# Altium schematic sheet TopLevelDesign.SchDoc
size A; SheetNumber: 2; SheetTotal: 5
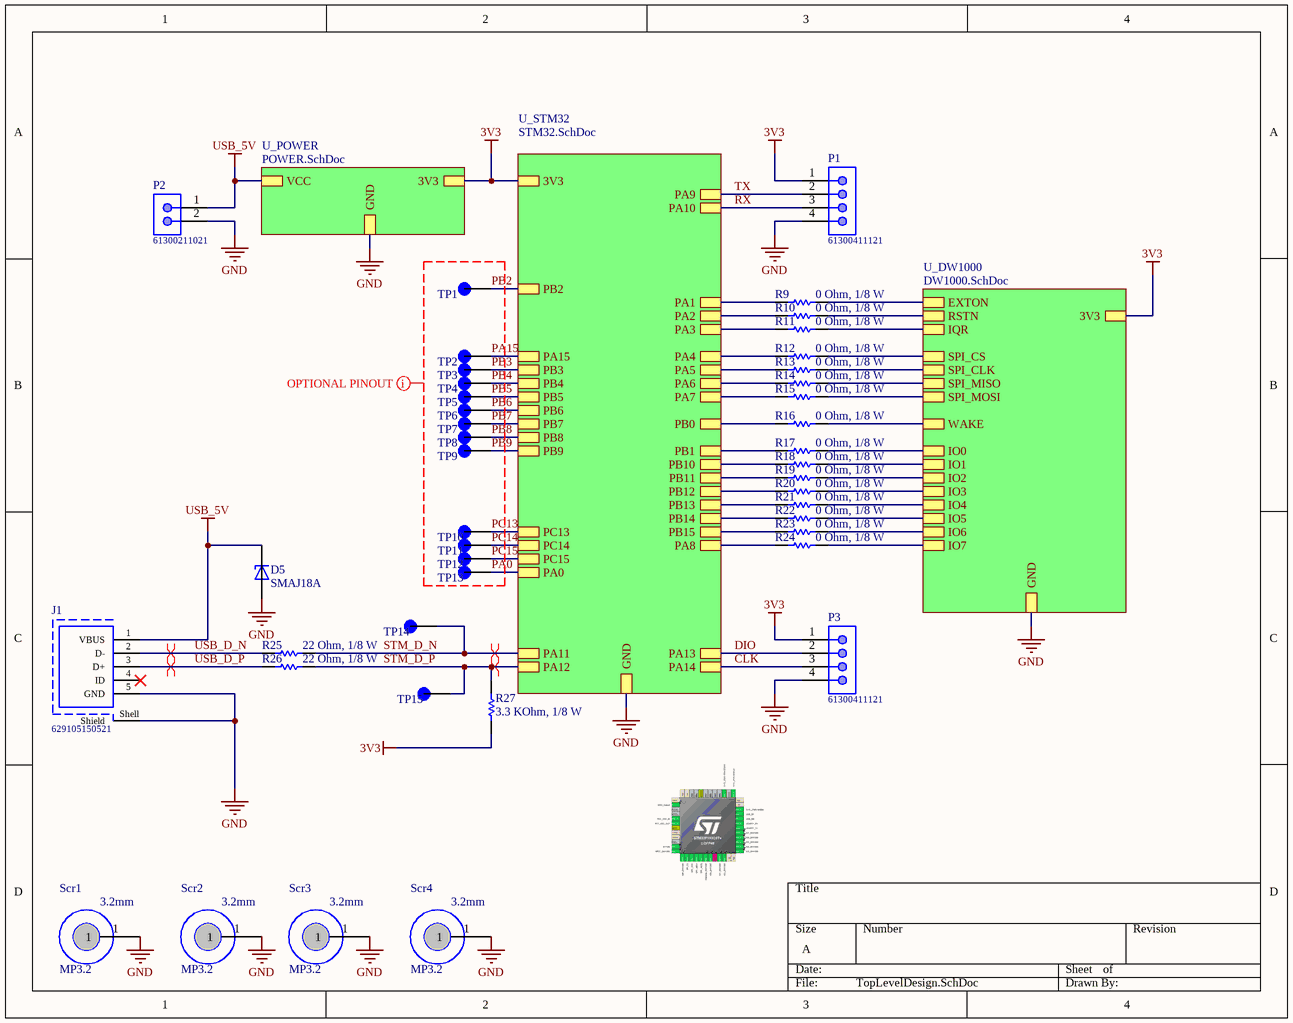
[diagram p0: TopLevelDesign.SchDoc]

## Parts
D5  SMAJ18A  [DIOM4325X250N]
J1  629105150521  [629105150521]
P1  61300411121  [61300411121]
P2  61300211021  [61300211021]
P3  61300411121  [61300411121]
R9  value 0 Ohm, 1/8 W  [RESISTOR_0805]  (hidden comment: 0008050001)
R10  value 0 Ohm, 1/8 W  [RESISTOR_0805]  (hidden comment: 0008050001)
R11  value 0 Ohm, 1/8 W  [RESISTOR_0805]  (hidden comment: 0008050001)
R12  value 0 Ohm, 1/8 W  [RESISTOR_0805]  (hidden comment: 0008050001)
R13  value 0 Ohm, 1/8 W  [RESISTOR_0805]  (hidden comment: 0008050001)
R14  value 0 Ohm, 1/8 W  [RESISTOR_0805]  (hidden comment: 0008050001)
R15  value 0 Ohm, 1/8 W  [RESISTOR_0805]  (hidden comment: 0008050001)
R16  value 0 Ohm, 1/8 W  [RESISTOR_0805]  (hidden comment: 0008050001)
R17  value 0 Ohm, 1/8 W  [RESISTOR_0805]  (hidden comment: 0008050001)
R18  value 0 Ohm, 1/8 W  [RESISTOR_0805]  (hidden comment: 0008050001)
R19  value 0 Ohm, 1/8 W  [RESISTOR_0805]  (hidden comment: 0008050001)
R20  value 0 Ohm, 1/8 W  [RESISTOR_0805]  (hidden comment: 0008050001)
R21  value 0 Ohm, 1/8 W  [RESISTOR_0805]  (hidden comment: 0008050001)
R22  value 0 Ohm, 1/8 W  [RESISTOR_0805]  (hidden comment: 0008050001)
R23  value 0 Ohm, 1/8 W  [RESISTOR_0805]  (hidden comment: 0008050001)
R24  value 0 Ohm, 1/8 W  [RESISTOR_0805]  (hidden comment: 0008050001)
R25  value 22 Ohm, 1/8 W  [RESISTOR_0805]  (hidden comment: 0008052205)
R26  value 22 Ohm, 1/8 W  [RESISTOR_0805]  (hidden comment: 0008052205)
R27  value 3.3 KOhm, 1/8 W  [RESISTOR_0805]  (hidden comment: 0008053325)
Scr1  MP3.2  [MP3.2]
Scr2  MP3.2  [MP3.2]
Scr3  MP3.2  [MP3.2]
Scr4  MP3.2  [MP3.2]
TP1  Keystone_SMD  [KEYSTONE_5019]  (value not drawn)
TP2  Keystone_SMD  [KEYSTONE_5019]  (value not drawn)
TP3  Keystone_SMD  [KEYSTONE_5019]  (value not drawn)
TP4  Keystone_SMD  [KEYSTONE_5019]  (value not drawn)
TP5  Keystone_SMD  [KEYSTONE_5019]  (value not drawn)
TP6  Keystone_SMD  [KEYSTONE_5019]  (value not drawn)
TP7  Keystone_SMD  [KEYSTONE_5019]  (value not drawn)
TP8  Keystone_SMD  [KEYSTONE_5019]  (value not drawn)
TP9  Keystone_SMD  [KEYSTONE_5019]  (value not drawn)
TP10  Keystone_SMD  [KEYSTONE_5019]  (value not drawn)
TP11  Keystone_SMD  [KEYSTONE_5019]  (value not drawn)
TP12  Keystone_SMD  [KEYSTONE_5019]  (value not drawn)
TP13  Keystone_SMD  [KEYSTONE_5019]  (value not drawn)
TP14  Keystone_SMD  [KEYSTONE_5019]  (value not drawn)
TP15  Keystone_SMD  [KEYSTONE_5019]  (value not drawn)

## Sub-sheets
U_DW1000 = DW1000.SchDoc: RSTN, IQR, SPI_CS, SPI_CLK, SPI_MOSI, SPI_MISO, EXTON, IO7, IO6, IO5, IO4, IO3, IO2, IO1, IO0, WAKE, 3V3, GND
U_POWER = POWER.SchDoc: VCC, 3V3, GND
U_STM32 = STM32.SchDoc: PB1, PB10, PB11, PB12, PB13, PB14, PB15, PA8, PA9, PA0, PA13, PA14, PA15, PA1, PA2, PA3, PA4, PA5, PA6, PA7, PB2, PB0, PB3, PB5, PB6, PB4, PB7, PA10, PA11, PB8, PB9, PA12, PC13, PC14, PC15, 3V3, GND

## Nets
3V3: P1.1 P3.1 R27.1 ; sheet U_DW1000/3V3, sheet U_STM32/3V3, sheet U_POWER/3V3
GND: D5.A J1.5(GND) J1.Shell(Shield) P1.4 P2.2 P3.4 Scr1.1 Scr2.1 Scr3.1 Scr4.1 ; sheet U_DW1000/GND, sheet U_STM32/GND, sheet U_POWER/GND
USB_5V: D5.C J1.1(VBUS) P2.1 ; sheet U_POWER/VCC
CLK: P3.3 ; sheet U_STM32/PA14
DIO: P3.2 ; sheet U_STM32/PA13
PA0: TP13.TP ; sheet U_STM32/PA0
PA15: TP2.TP ; sheet U_STM32/PA15
PB2: TP1.TP ; sheet U_STM32/PB2
PB3: TP3.TP ; sheet U_STM32/PB3
PB4: TP4.TP ; sheet U_STM32/PB4
PB5: TP5.TP ; sheet U_STM32/PB5
PB6: TP6.TP ; sheet U_STM32/PB6
PB7: TP7.TP ; sheet U_STM32/PB7
PB8: TP8.TP ; sheet U_STM32/PB8
PB9: TP9.TP ; sheet U_STM32/PB9
PC13: TP10.TP ; sheet U_STM32/PC13
PC14: TP11.TP ; sheet U_STM32/PC14
PC15: TP12.TP ; sheet U_STM32/PC15
RX: P1.3 ; sheet U_STM32/PA10
STM_D_N: R25.2 TP14.TP ; sheet U_STM32/PA11
STM_D_P: R26.2 R27.2 TP15.TP ; sheet U_STM32/PA12
TX: P1.2 ; sheet U_STM32/PA9
USB_D_N: J1.2(D-) R25.1
USB_D_P: J1.3(D+) R26.1
NetR9_1: R9.1 ; sheet U_STM32/PA1
NetR9_2: R9.2 ; sheet U_DW1000/EXTON
NetR10_1: R10.1 ; sheet U_STM32/PA2
NetR10_2: R10.2 ; sheet U_DW1000/RSTN
NetR11_1: R11.1 ; sheet U_STM32/PA3
NetR11_2: R11.2 ; sheet U_DW1000/IQR
NetR12_1: R12.1 ; sheet U_STM32/PA4
NetR12_2: R12.2 ; sheet U_DW1000/SPI_CS
NetR13_1: R13.1 ; sheet U_STM32/PA5
NetR13_2: R13.2 ; sheet U_DW1000/SPI_CLK
NetR14_1: R14.1 ; sheet U_STM32/PA6
NetR14_2: R14.2 ; sheet U_DW1000/SPI_MISO
NetR15_1: R15.1 ; sheet U_STM32/PA7
NetR15_2: R15.2 ; sheet U_DW1000/SPI_MOSI
NetR16_1: R16.1 ; sheet U_STM32/PB0
NetR16_2: R16.2 ; sheet U_DW1000/WAKE
NetR17_1: R17.1 ; sheet U_STM32/PB1
NetR17_2: R17.2 ; sheet U_DW1000/IO0
NetR18_1: R18.1 ; sheet U_STM32/PB10
NetR18_2: R18.2 ; sheet U_DW1000/IO1
NetR19_1: R19.1 ; sheet U_STM32/PB11
NetR19_2: R19.2 ; sheet U_DW1000/IO2
NetR20_1: R20.1 ; sheet U_STM32/PB12
NetR20_2: R20.2 ; sheet U_DW1000/IO3
NetR21_1: R21.1 ; sheet U_STM32/PB13
NetR21_2: R21.2 ; sheet U_DW1000/IO4
NetR22_1: R22.1 ; sheet U_STM32/PB14
NetR22_2: R22.2 ; sheet U_DW1000/IO5
NetR23_1: R23.1 ; sheet U_STM32/PB15
NetR23_2: R23.2 ; sheet U_DW1000/IO6
NetR24_1: R24.1 ; sheet U_STM32/PA8
NetR24_2: R24.2 ; sheet U_DW1000/IO7

Not connected (* = marked no-connect by the designer): J1 4(ID)*

## Layout directives
differential pair: STM_D_N, STM_D_P, USB_D_N, USB_D_P
mark named OPTIONAL PINOUT: PA0, PA15, PB2, PB3, PB4, PB5, PB6, PB7, PB8, PB9, PC13, PC14, PC15

## Notes on the sheet
- (in symbol CMP-143-000000-1) 3.2mm

## Library data of the parts
D5 = CMP-004-00085-1: 400W, 21.1V, 5%, Unidirectional, TVS; MF: Taiwan Semiconductor; SnapEDA_Link: https://www.snapeda.com/parts/SMAJ18A/taiwan/view-part/?ref=snap; Value: *; Component Type: Standard; Case/Package: SMA-2 Taiwan Semiconductor; Check_prices: https://www.snapeda.com/parts/SMAJ18A/taiwan/view-part/?ref=eda; Source: SMAJ18A.SchLib; Design Item ID: SMAJ18A; Pins: 2; MP: SMAJ18A
J1 = CMP-111-000023-1: Micro USB 2.0 Type B Receptacle WR-COM, Horizontal, SMT, with Pegs, High Current at Pin 1 & Pin 5; Contact Resistance: 30 mOhm; Rated Current: 3 A; Working Voltage: 30 VAC; ComponentLink2URL: N/A; Operating Temperature: -40 to 85 degC; Packaging: Tape and Reel; ComponentLink2Description: Supplier 1 URL; Supplier 2 URL: N/A; Source: USB Connectors WR-COM.SchLib; Supplier 1 Name: Mouser; Supplier 1 URL: https://www.mouser.vn/ProductDetail/Wurth-Elektronik/629105150521?qs=a9WhcLg8qCzXiH7kZP8GRQ%3D%3D; Value: Micro USB 2.0 Type B; ComponentLink1Description: Datasheet; ComponentLink1URL: https://katalog.we-online.de/em/datasheet/629105150521.pdf; Published Date: September 2018; Supplier 3 SN: N/A; Pin Count: 6; Connector Type: Micro USB 2.0 Type B; Design Item ID: 629105150521; Component Type: Standard; ComponentLink4URL: N/A; ComponentLink3Description: Supplier 2 URL; Supplier 2 SN: N/A; ComponentLink3URL: N/A; Orientation: Horizontal; Gender: Receptacle; ComponentLink4Description: Supplier 3 URL; Supplier 1 SN: 710-629105150521; Supplier 3 URL: N/A; Supplier 3 Name: thegioiic; Mounting Technology: SMT; Supplier 2 Name: Digi-Key; Part Number: 629105150521; Publisher: Wurth Elektronik
P1 P3 = CMP-002-00474-1: WR-PHD Pin Header, THT, pitch 2.54mm, Single Row, Vertical, 4p; Manufacturer: Wurth Elektronik; Rated Current: 3A; Contact Resistance: 20mOhm; Withstanding Voltage: 500VAC; Supply name 1: Mouser; Pin Number: 4; Working Voltage: 250VAC; Published Date: May 2020; Supplier 3 URL: N/A; Supplier 2 URL: N/A; Source: WR-PHD_Pin Header_2.54mm.SchLib; ComponentLink3Description: Global Supply; Operating Temperature: -40 to +105degC; ComponentLink1Description: Manufacturer; Component Type: Standard; ComponentLink1URL: http://www.we-online.de; ComponentLink2URL: https://www.we-online.com/catalog/datasheet/61300411121.pdf; ComponentLink2Description: Datasheet; ComponentLink4Description: Global Supply; ComponentLink4URL: https://www.mouser.vn/ProductDetail/Wurth-Elektronik/61300411121?qs=PhR8RmCirEYQcLLqXD8rAA%3D%3D; Pitch: 2.54mm; Mounting Technology: THT; Supplier 2 SN: N/A; Row Number: Single; Supplier 3 Name: thegioiic; Supplier 2 Name: Digi-Key; Supplier 1 URL: https://www.mouser.vn/ProductDetail/Wurth-Elektronik/61300311121?qs=PhR8RmCirEYxRWFJzNKsUw%3D%3D; Supplier 1 SN: 710-61300311121; Supplier 3 SN: N/A; Pins: 4; Orientation: Vertical; Gender: Pin Header; Packaging: Bag; ComponentLink3URL: https://www.we-online.com/en/components/products/PHD_2_54_THT_PIN_HEADER_6130XX11121?sq=61300411121#61300411121; Supplier 1 Name: Mouser; Design Item ID: 61300411121; Manufacturer Part Number: 61300411121
P2 = CMP-002-00465-1: WR-PHD Pin Header, THT, pitch 2.54mm, Single Row, Angled, 2p; Manufacturer: Wurth Elektronik; Contact Resistance: 20mOhm; Working Voltage: 250VAC; Supply name 1: Mouser; Pin Number: 2; Rated Current: 3A; Withstanding Voltage: 500VAC; Manufacturer Part Number: 61300211021; Supplier 3 SN: N/A; ComponentLink3Description: Global Supply; Supplier 3 URL: N/A; Supplier 1 URL: https://www.mouser.vn/ProductDetail/Wurth-Elektronik/61300211021?qs=PhR8RmCirEbDcrt4YhPPpA%3D%3D; ComponentLink3URL: https://www.we-online.com/en/components/products/PHD_2_54_THT_ANGLED_PIN_HEADER_6130XX11021?sq=61300211021#61300211021; ComponentLink1Description: Manufacturer; ComponentLink1URL: http://www.we-online.de; Pitch: 2.54mm; Supplier 1 SN: 710-61300211021; Pins: 2; Design Item ID: 61300211021; Supplier 2 SN: N/A; Operating Temperature: -40 to +105degC; Orientation: Angled; ComponentLink2URL: https://www.we-online.com/catalog/datasheet/61300211021.pdf; Component Type: Standard; Source: WR-PHD_Pin Header_2.54mm.SchLib; Supplier 2 URL: N/A; Mounting Technology: THT; Row Number: Single; ComponentLink4Description: Global Supply; ComponentLink4URL: https://www.mouser.vn/ProductDetail/Wurth-Elektronik/61300211021?qs=PhR8RmCirEbDcrt4YhPPpA%3D%3D; ComponentLink2Description: Datasheet; Supplier 3 Name: thegioiic; Supplier 2 Name: Digi-Key; Gender: Pin Header; Supplier 1 Name: Mouser; Packaging: Bag; Published Date: May 2020
R9-R24 = CMP-009-00415-1: RES, size 0805, 0 Ohm, 1/8 W; Manufacture  Name: YAGEO; Manufacture  SN: RC0805FR-070RL; Rated Power: 1/8 W; Resistance Tolerance: +/-1%; ComponentLink1URL: N/A; Component Type: Standard; Mounting Technology: SMT; Source: Resistor_0805.SchLib; ComponentLink3URL: https://www.digikey.com/en/products/detail/yageo/rc0805fr-070rl/2827620; Supplier 3 Name: Thegioiic; Size: 0805; ComponentLink1Description: Datasheet link; Design Item ID: 0008050001; ComponentLink2Description: Supplier 1 URL; Supplier 2 Name: Digi-Key; Supplier 2 SN: 311-0.0CRTR-ND; Supplier 1 URL: https://www.mouser.com/ProductDetail/YAGEO/RC0805FR-070RL?qs=fRxXYNj8ftF6kXqh1XbZJQ%3D%3D; Supplier 2 URL: https://www.digikey.com/en/products/detail/yageo/rc0805fr-070rl/2827620; ComponentLink3Description: Supplier 2 URL; Pins: 2; ComponentLink2URL: https://www.mouser.com/ProductDetail/YAGEO/RC0805FR-070RL?qs=fRxXYNj8ftF6kXqh1XbZJQ%3D%3D; Supplier 1 Name: Mouser; Supplier 3 URL: https://www.thegioiic.com/dien-tro-0-ohm-0805-1-; ComponentLink4URL: https://www.thegioiic.com/dien-tro-0-ohm-0805-1-; Supplier 1 SN: 603-RC0805FR-070RL; ComponentLink4Description: Supplier 3 URL; Supplier 3 SN: N/A
R25 R26 = CMP-009-00539-1: RES, size 0805, 22 Ohm, 1/8 W; Manufacture  Name: Bourns; Manufacture  SN: CR0805-JW-200ELF; Rated Power: 1/8 W; Resistance Tolerance: +/-5%; Component Type: Standard; ComponentLink1Description: Datasheet link; ComponentLink4Description: Supplier 3 URL; ComponentLink4URL: https://www.thegioiic.com/dien-tro-20-ohm-0805-5-; Pins: 2; ComponentLink2URL: https://www.mouser.vn/ProductDetail/Bourns/CR0805-JW-200ELF?qs=wL7NMIHXUPkPRFW4oSYkFg%3D%3D; Mounting Technology: SMT; Size: 0805; Supplier 2 SN: CHP0805-JW-200ELFTR-ND - Tape & Reel (TR); Supplier 2 URL: https://www.digikey.com/en/products/detail/bourns-inc/CHP0805-JW-200ELF/9598606; Supplier 1 URL: https://www.mouser.vn/ProductDetail/Bourns/CR0805-JW-200ELF?qs=wL7NMIHXUPkPRFW4oSYkFg%3D%3D; Supplier 2 Name: Digi-Key; ComponentLink1URL: https://www.mouser.vn/datasheet/2/54/cr-1858361.pdf; Supplier 3 Name: Thegioiic; Supplier 3 SN: N/A; ComponentLink3URL: https://www.digikey.com/en/products/detail/bourns-inc/CHP0805-JW-200ELF/9598606; Supplier 1 SN: 652-CR0805JW-200ELF; ComponentLink2Description: Supplier 1 URL; Design Item ID: 0008052205; Supplier 1 Name: Mouser; ComponentLink3Description: Supplier 2 URL; Source: Resistor_0805.SchLib; Supplier 3 URL: https://www.thegioiic.com/dien-tro-20-ohm-0805-5-
R27 = CMP-009-00577-1: RES, size 0805, 3.3 KOhm, 1/8 W; Manufacture  SN: ERJ-S06J332V; Manufacture  Name: Panasonic; Rated Power: 1/8 W; Resistance Tolerance: +/-5%; ComponentLink4Description: Supplier 3 URL; Supplier 2 SN: P3.3KATR-ND - Tape & Reel (TR); Supplier 1 SN: 667-ERJ-S06J332V; ComponentLink3Description: Supplier 2 URL; ComponentLink1URL: https://www.mouser.vn/datasheet/2/315/AOA0000C334-1314047.pdf; Supplier 3 Name: Thegioiic; Component Type: Standard; ComponentLink4URL: https://www.thegioiic.com/dien-tro-3-3-kohm-0805-5; ComponentLink3URL: https://www.digikey.com/en/products/detail/panasonic-electronic-components/ERJ-6GEYJ332V/83038; Supplier 1 Name: Mouser; Supplier 2 URL: https://www.digikey.com/en/products/detail/panasonic-electronic-components/ERJ-6GEYJ332V/83038; ComponentLink2Description: Supplier 1 URL; Pins: 2; Size: 0805; ComponentLink1Description: Datasheet link; Supplier 3 SN: N/A; Supplier 3 URL: https://www.thegioiic.com/dien-tro-3-3-kohm-0805-5; ComponentLink2URL: https://www.mouser.vn/ProductDetail/Panasonic/ERJ-S06J332V?qs=Lnc17S3XxqC89pwdWk%2FMHQ%3D%3D; Design Item ID: 0008053325; Mounting Technology: SMT; Supplier 2 Name: Digi-Key; Supplier 1 URL: https://www.mouser.vn/ProductDetail/Panasonic/ERJ-S06J332V?qs=Lnc17S3XxqC89pwdWk%2FMHQ%3D%3D; Source: Resistor_0805.SchLib
Scr1-Scr4 = CMP-143-000000-1: Component Type: Standard; Pin Count: 1; Source: MP_3P2.SchLib; Design Item ID: MP3.2
TP1-TP15 = CMP-327-000001-2: Test Point, Mini, SMT, Phos Bronze/Silver, 1000pc Tape & Reel; MF: Keystone Electronics; MP: 5019; Component Type: Standard; Value: *; Pin Count: 1; Package: NON STANDARD-1 Keystone; Design Item ID: 5019; Source: 5019.SchLib; Check_prices: https://www.snapeda.com/parts/5019/Keystone/view-part/?ref=eda; SnapEDA_Link: https://www.snapeda.com/parts/5019/Keystone/view-part/?ref=snap